# Altium schematic sheet InputDigital.SchDoc
size A4; SheetNumber: 2; SheetTotal: 4
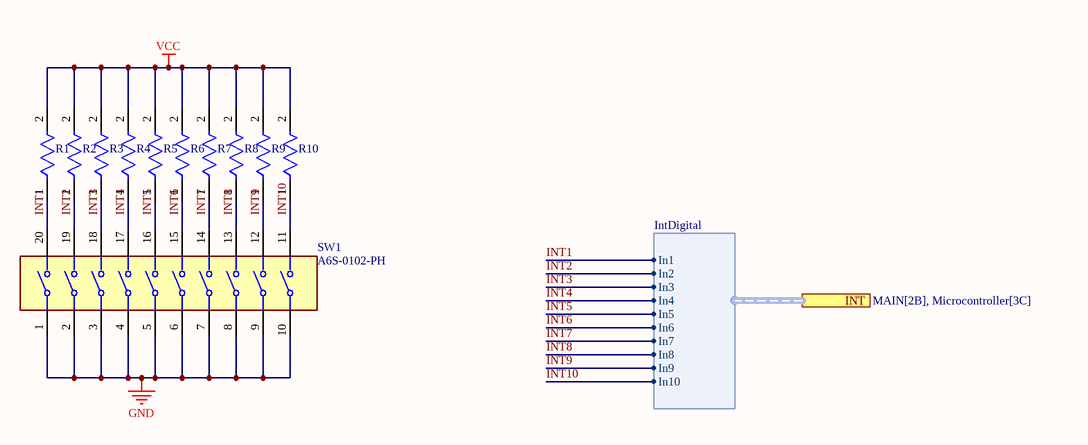
[diagram p0: InputDigital.SchDoc]

## Parts
R1  RT0805BRD07249RL  [FP-RT0805-MFG]  (value not drawn)
R2  RT0805BRD07249RL  [FP-RT0805-MFG]  (value not drawn)
R3  RT0805BRD07249RL  [FP-RT0805-MFG]  (value not drawn)
R4  RT0805BRD07249RL  [FP-RT0805-MFG]  (value not drawn)
R5  RT0805BRD07249RL  [FP-RT0805-MFG]  (value not drawn)
R6  RT0805BRD07249RL  [FP-RT0805-MFG]  (value not drawn)
R7  RT0805BRD07249RL  [FP-RT0805-MFG]  (value not drawn)
R8  RT0805BRD07249RL  [FP-RT0805-MFG]  (value not drawn)
R9  RT0805BRD07249RL  [FP-RT0805-MFG]  (value not drawn)
R10  RT0805BRD07249RL  [FP-RT0805-MFG]  (value not drawn)
SW1  A6S-0102-PH  [FP-A6S-0102-PH-MFG]

## Ports
INT (harness IntDigital, see MAIN[2B], Microcontroller[3C])

## Harnesses
IntDigital: In1, In2, In3, In4, In5, In6, In7, In8, In9, In10

## Nets
GND: SW1.1 SW1.2 SW1.3 SW1.4 SW1.5 SW1.6 SW1.7 SW1.8 SW1.9 SW1.10
VCC: R1.2 R2.2 R3.2 R4.2 R5.2 R6.2 R7.2 R8.2 R9.2 R10.2
INT1: R1.1 SW1.20 ; port INT.In1
INT2: R2.1 SW1.19 ; port INT.In2
INT3: R3.1 SW1.18 ; port INT.In3
INT4: R4.1 SW1.17 ; port INT.In4
INT5: R5.1 SW1.16 ; port INT.In5
INT6: R6.1 SW1.15 ; port INT.In6
INT7: R7.1 SW1.14 ; port INT.In7
INT8: R8.1 SW1.13 ; port INT.In8
INT9: R9.1 SW1.12 ; port INT.In9
INT10: R10.1 SW1.11 ; port INT.In10

## Library data of the parts
R1-R10 = CMP-03412-035801-1: RES SMD 249 OHM 0.1% 1/8W 0805; Manufacturer: Yageo; Power Rating: 0.125W; Voltage Rating: 150V; Value: 249Ω; Temperature Coefficient: 25 ppm/°C; Tolerance: 0.0025; Device Class L2: Resistors; Composition: Thin Film; RoHS: TRUE; Digikey Description: RES SMD 249 OHM 0.1% 1/8W 0805; Octopart: https://octopart.com/rt0805brd07249rl-yageo-1410573; Temperature Range Low: -55°C; Ipc Land Pattern Name: RESC200125X50; Device Class L3: Chip SMD Resistors; Category: Res; Automotive: No; ComponentLink2Description: Datasheet; Manufacturer Part Number: RT0805BRD07249RL; Temperature: -55°C to +155°C; Height: 0.6mm; Mouser Description: Res SMD 249 Ohm .1% 0805; Resistance: 249Ω; ComponentLink2URL: http://www.yageo.com/documents/recent/PYu-RT_1-to-0.01_RoHS_L_9.pdf; Lead Free: Yes; Package: RT0805; Series: RT; Temperature Range High: +155°C; Footprint Url: http://www.yageo.com/exep/pages/download/literatures/PYu-R_Mount_10.pdf; Device Class L1: Passive Components
SW1 = CMP-08827-000074-1: SWITCH SLIDE DIP SPST 25MA 24V; Washable: Yes; Pitch: 0.1inch; Actuator Type: Slide (Standard); Mechanical Life: 1000Cycles; Number of Positions: 10; Actuator Length: 0mm; Contact Resistance: 200mR; Current Rating: 25mA; Weight: 0.87g; Max Operating Temperature: 70°C; Length: 1.037inch; Throw Configuration: SPST; Termination: Gull Wing; Max Voltage Rating (DC): 24V; Voltage Rating (DC): 24V; Package Quantity: 900; Max Current Rating: 25mA; Case/Package: DIP; Contact Plating: Gold; Orientation: Straight; Series: A6S-H; Mount: Surface Mount; Terminal Pitch: 2.54mm; Radiation Hardening: No; Electrical Life: 1000Cycles; RoHS Compliant: Yes; Packaging: Tape and Reel; Min Operating Temperature: -20°C